# Altium schematic sheet Index.SchDoc
size A4; Date: 2025-01-26; Engineer: Ganghyeok Lim; Revision: A; SheetNumber: 1; SheetTotal: 2
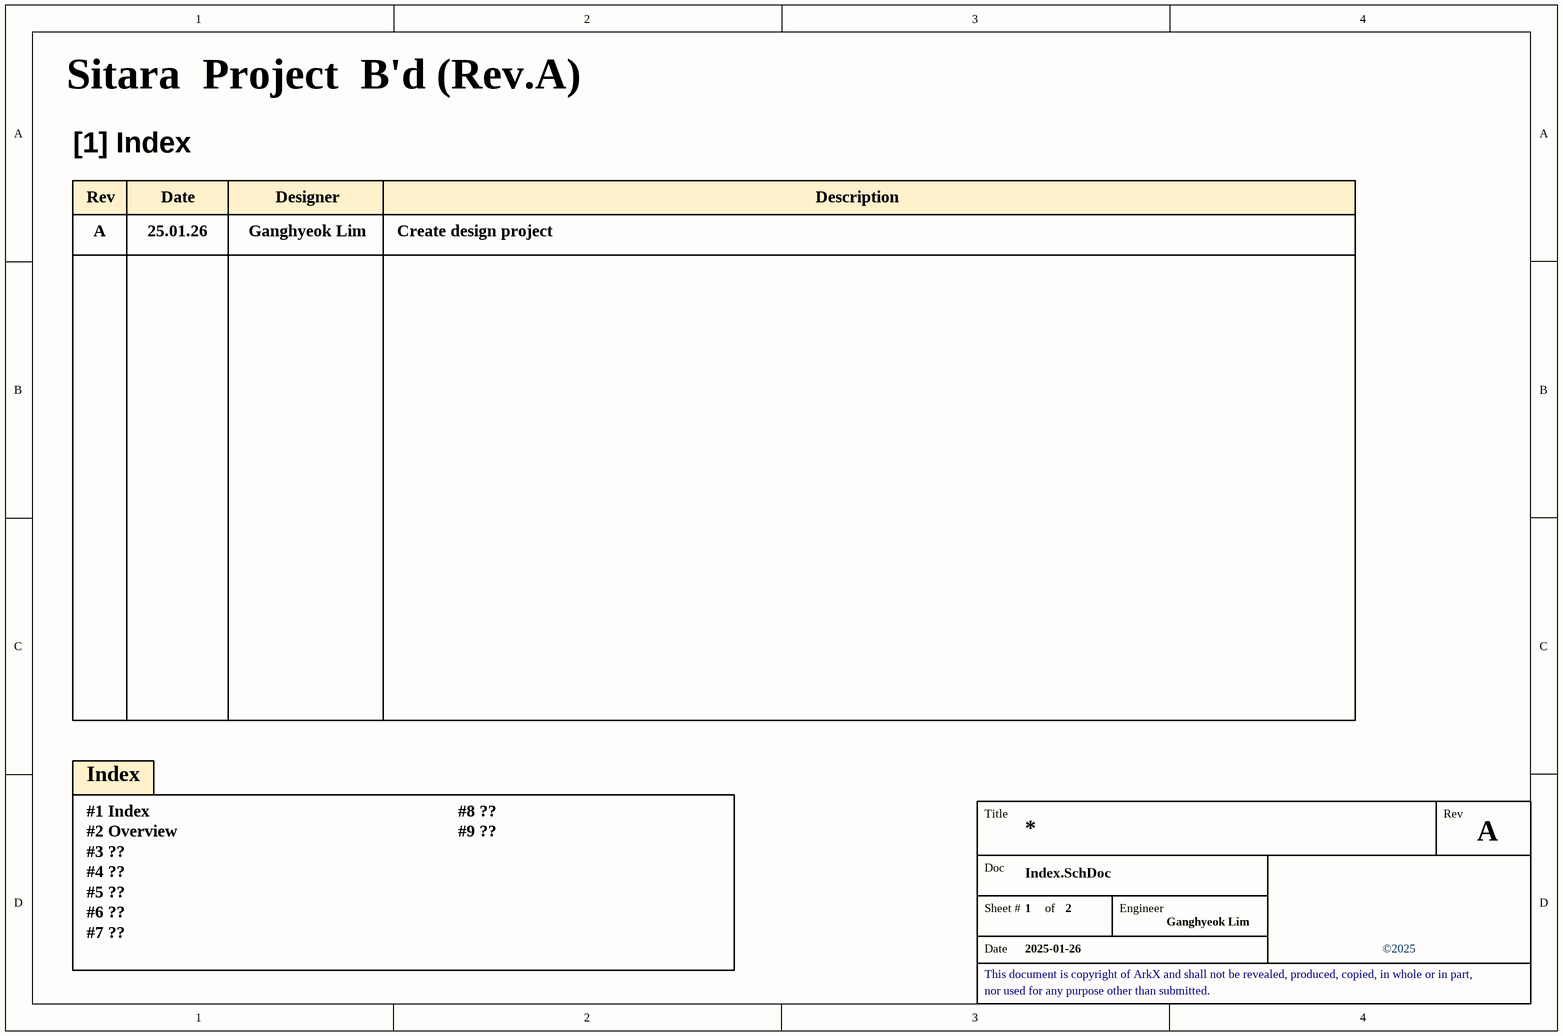
[diagram p0: Index.SchDoc]

## Notes on the sheet
- Sitara  Project  B'd (Rev.A)
- [1] Index
- Rev
- A
- 25.01.26
- Date
- Ganghyeok Lim
- Designer
- Create design project
- Description
- Index
- #1 Index
- #2 Overview
- #8 ??
- #9 ??
- #3 ??
- #4 ??
- #5 ??
- #6 ??
- #7 ??
- Title
- Doc
- Sheet #
- of
- Engineer
- This document is copyright of ArkX and shall not be revealed, produced, copied, in whole or in part,
- ©2025
- nor used for any purpose other than submitted.